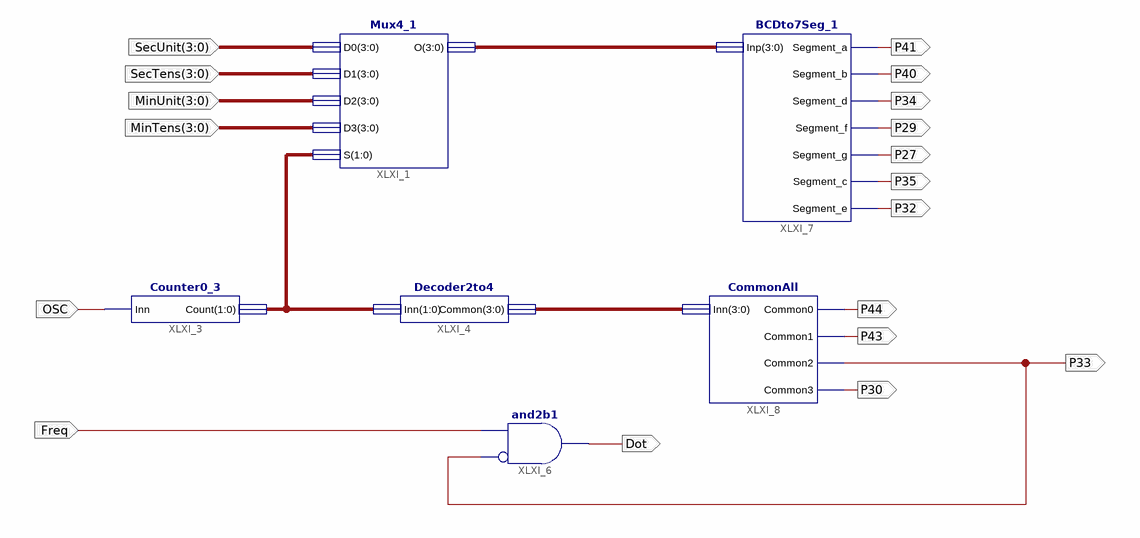
[diagram p0: schematic sheet 1]
// Xilinx ISE schematic Display_1.sch (spartan6) as structural Verilog: 6 symbols, 18 ports
module Display_1 (
  input  [3:0] SecUnit,
  input  [3:0] SecTens,
  input  [3:0] MinUnit,
  input  [3:0] MinTens,
  input  OSC,
  input  Freq,
  output Dot,
  output P33,
  output P41,
  output P40,
  output P34,
  output P29,
  output P27,
  output P35,
  output P32,
  output P44,
  output P43,
  output P30
);

  wire [1:0] XLXN_10;
  wire [3:0] XLXN_8, XLXN_12;

  Mux4_1 XLXI_1 (.D0(SecUnit), .D1(SecTens), .D2(MinUnit), .D3(MinTens), .S(XLXN_10), .O(XLXN_8));
  Counter0_3 XLXI_3 (.Count(XLXN_10), .Inn(OSC));
  Decoder2to4 XLXI_4 (.Inn(XLXN_10), .Common(XLXN_12));
  and XLXI_6 (Dot, ~P33, Freq);  // and2b1
  BCDto7Seg_1 XLXI_7 (
    .Inp(XLXN_8), .Segment_a(P41), .Segment_b(P40), .Segment_d(P34), .Segment_f(P29), .Segment_g(P27),
    .Segment_c(P35), .Segment_e(P32));
  CommonAll XLXI_8 (.Inn(XLXN_12), .Common0(P44), .Common1(P43), .Common2(P33), .Common3(P30));
endmodule
